# Altium schematic sheet LVHV8ChanTranslation.SchDoc: 8-channel LV to HV Translation
size Letter; Engineer: Prasoon Sinha; DocumentNumber: 20; Revision: v1.2; SheetNumber: 20; SheetTotal: 26
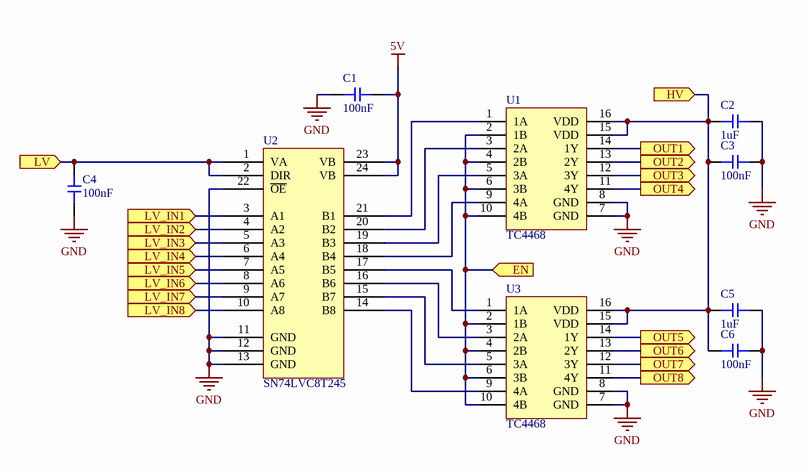
[diagram p0: LVHV8ChanTranslation.SchDoc]

## Parts
C1  value 100nF  [0603-CAP]  (hidden comment: Capacitor)
C2  value 1uF  [0603-CAP]  (hidden comment: Capacitor)
C3  value 100nF  [0603-CAP]  (hidden comment: Capacitor)
C4  value 100nF  [0603-CAP]  (hidden comment: Capacitor)
C5  value 1uF  [0603-CAP]  (hidden comment: Capacitor)
C6  value 100nF  [0603-CAP]  (hidden comment: Capacitor)
U1  TC4468  [SOIC16_N - wide]
U2  SN74LVC8T245  [TSOP65P640X120-24N]
U3  TC4468  [SOIC16_N - wide]

## Ports
EN (in), HV (in), LV (in), LV_IN1 (in), LV_IN2 (in), LV_IN3 (in), LV_IN4 (in), LV_IN5 (in), LV_IN6 (in), LV_IN7 (in), LV_IN8 (in), OUT1 (out), OUT2 (out), OUT3 (out), OUT4 (out), OUT5 (out), OUT6 (out), OUT7 (out), OUT8 (out)

## Nets
5V: C1.1 U2.23(VB) U2.24(VB)
GND: C1.2 C2.2 C3.2 C4.1 C5.2 C6.2 U1.7(GND) U1.8(GND) U2.11(GND) U2.12(GND) U2.13(GND) U2.22(~{OE}) U3.7(GND) U3.8(GND)
EN: U1.2(1B) U1.4(2B) U1.6(3B) U1.10(4B) U3.2(1B) U3.4(2B) U3.6(3B) U3.10(4B) ; port EN
HV: C2.1 C3.1 C5.1 C6.1 U1.15(VDD) U1.16(VDD) U3.15(VDD) U3.16(VDD) ; port HV
LV: C4.2 U2.1(VA) U2.2(DIR) ; port LV
LV_IN1: U2.3(A1) ; port LV_IN1
LV_IN2: U2.4(A2) ; port LV_IN2
LV_IN3: U2.5(A3) ; port LV_IN3
LV_IN4: U2.6(A4) ; port LV_IN4
LV_IN5: U2.7(A5) ; port LV_IN5
LV_IN6: U2.8(A6) ; port LV_IN6
LV_IN7: U2.9(A7) ; port LV_IN7
LV_IN8: U2.10(A8) ; port LV_IN8
OUT1: U1.14(1Y) ; port OUT1
OUT2: U1.13(2Y) ; port OUT2
OUT3: U1.12(3Y) ; port OUT3
OUT4: U1.11(4Y) ; port OUT4
OUT5: U3.14(1Y) ; port OUT5
OUT6: U3.13(2Y) ; port OUT6
OUT7: U3.12(3Y) ; port OUT7
OUT8: U3.11(4Y) ; port OUT8
NetU1_1: U1.1(1A) U2.21(B1)
NetU1_3: U1.3(2A) U2.20(B2)
NetU1_5: U1.5(3A) U2.19(B3)
NetU1_9: U1.9(4A) U2.18(B4)
NetU2_14: U2.14(B8) U3.9(4A)
NetU2_15: U2.15(B7) U3.5(3A)
NetU2_16: U2.16(B6) U3.3(2A)
NetU2_17: U2.17(B5) U3.1(1A)

## Notes on the sheet
- Title:
- File:
- Sheet:
- of
- Revision:
- Time:
- Date:
- Engineer:

## Library data of the parts
U1 U3 = TC4468: IC MOSFET DVR QUAD AND 16SOIC; Supplier 1: Digi-Key; Supplier Part Number 1: TC4468COE-ND
U2 = SN74LVC8T245PWR: IC BUS TRANSCVR 8BIT 24TSSOP; Supplier 1: Digi-Key; Supplier Part Number 1: 296-18593-1-ND
C1-C6 = Capacitor: Supplier 1: Digi-Key
  C1 C3 C4 C6: Supplier Part Number 1: 1276-1012-1-ND
  C2 C5: Supplier Part Number 1: 1276-6524-1-ND